# Altium schematic sheet Ch_trig.SchDoc
size A4
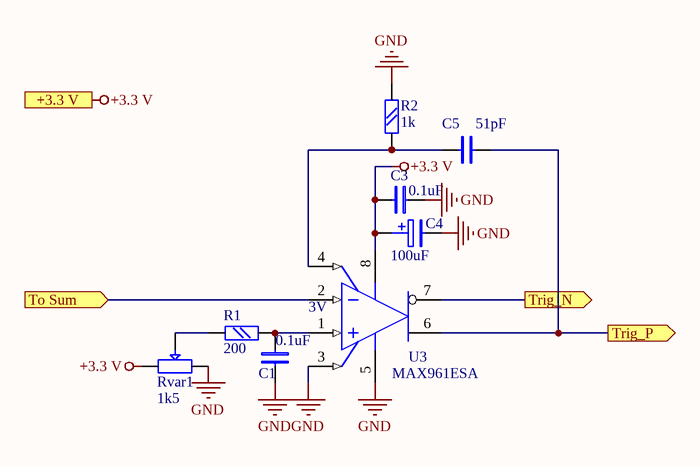
[diagram p0: Ch_trig.SchDoc]

## Parts
C1  0.1uF  [chip0805]
C3  0.1uF  [chip0805]
C4  100uF  [CEL-SMD300]
C5  51pF  [chip0805]
R1  200  [chip0805]
R2  1k  [chip0805]
Rvar1  1k5  [RVAR4]
U3  MAX961ESA  [NSO8_N]

## Ports
+3.3 V (in), To Sum (in), Trig_N (out), Trig_P (out)

## Nets
+3.3 V: C3.2 C4.+ Rvar1.1 U3.8(V+) ; port +3.3 V
GND: C1.1 C3.1 C4.- R2.2 Rvar1.3 U3.3(SHDN) U3.5(GND)
To Sum: U3.2(IN-) ; port To Sum
Trig_N: U3.7(~{Q}) ; port Trig_N
Trig_P: C5.2 U3.6(Q) ; port Trig_P
NetC1_2: C1.2 R1.2 U3.1(IN+)
NetC5_1: C5.1 R2.1 U3.4(LE)
NetR1_1: R1.1 Rvar1.2

## Notes on the sheet
- (near U3) 3V

## Library data of the parts
C1 C3 C5 = C: Text Field1: 20; Text Field2: 10
C4 = C POL: Text Field1: 20; Text Field2: 20
R1 R2 = R: Text Field1: 20; Text Field2: 20
Rvar1 = R VAR: Text Field1: 20; Text Field2: 20
U3 = MAX961ESA: Single Ultra-High-Speed, +3V/+5V, Beyond-the-Rails Comparator; Published: 16-Jan-2001; LatestRevisionDate: 13-Apr-2006; LatestRevisionNote: IPC-7351 Footprint Added.; DatasheetVersion: Jan-1998; PackageReference: NSO8; Publisher: Altium Limited; PackageDescription: 8-Pin Small Outline Integrated Circuit 1.27 mm Pitch; Code_JEDEC: MS-012-AA; Code_IPC: SOIC127P600-8; ComponentLink1Description: Manufacturer Link; ComponentLink1URL: http://www.maxim-ic.com/; ComponentLink2Description: Datasheet; ComponentLink2URL: http://pdfserv.maxim-ic.com/en/ds/MAX961-MAX999.pdf